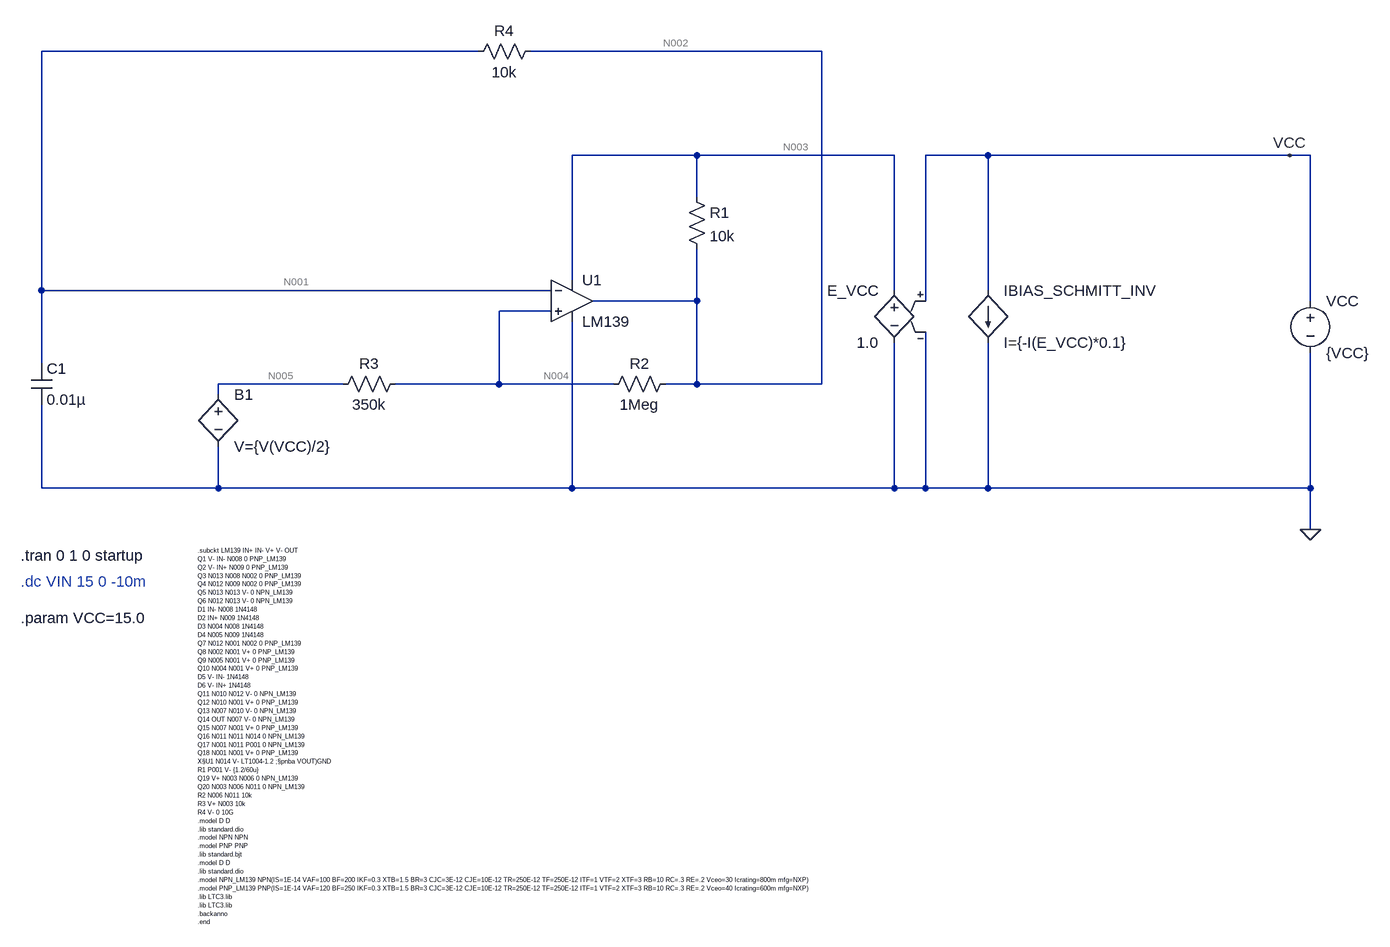
[diagram p0: schematic LM139_Comparator_with_Hysterisis.asc]
LM139_Comparator_with_Hysterisis.asc, the LTspice schematic file:
Version 4.1
SHEET 1 2348 1388
WIRE -16 -592 -688 -592
WIRE 512 -592 64 -592
WIRE 320 -432 128 -432
WIRE 624 -432 320 -432
WIRE 768 -432 672 -432
WIRE 1232 -432 768 -432
WIRE 1264 -432 1232 -432
WIRE 320 -368 320 -432
WIRE 128 -240 128 -432
WIRE -688 -224 -688 -592
WIRE 96 -224 -688 -224
WIRE 624 -224 624 -432
WIRE 768 -224 768 -432
WIRE 320 -208 320 -288
WIRE 320 -208 160 -208
WIRE 672 -208 672 -432
WIRE 1264 -208 1264 -432
WIRE 96 -192 16 -192
WIRE -688 -112 -688 -224
WIRE -224 -80 -416 -80
WIRE 16 -80 16 -192
WIRE 16 -80 -144 -80
WIRE 192 -80 16 -80
WIRE 320 -80 320 -208
WIRE 320 -80 272 -80
WIRE 512 -80 512 -592
WIRE 512 -80 320 -80
WIRE -416 -64 -416 -80
WIRE -688 80 -688 -48
WIRE -416 80 -416 16
WIRE -416 80 -688 80
WIRE 128 80 128 -176
WIRE 128 80 -416 80
WIRE 624 80 624 -144
WIRE 624 80 128 80
WIRE 672 80 672 -160
WIRE 672 80 624 80
WIRE 768 80 768 -144
WIRE 768 80 672 80
WIRE 1264 80 1264 -128
WIRE 1264 80 768 80
WIRE 1264 144 1264 80
FLAG 1264 144 0
FLAG 1232 -432 VCC
SYMBOL OpAmps\\opamp2 128 -272 R0
SYMATTR InstName U1
SYMATTR Value LM139
SYMBOL res 304 -384 R0
SYMATTR InstName R1
SYMATTR Value 10k
SYMBOL res 288 -96 R90
WINDOW 0 0 56 VBottom 2
WINDOW 3 32 56 VTop 2
SYMATTR InstName R2
SYMATTR Value 1Meg
SYMBOL voltage 1264 -224 R0
WINDOW 123 0 0 Left 0
WINDOW 39 0 0 Left 0
SYMATTR InstName VCC
SYMATTR Value {VCC}
SYMBOL res -240 -64 R270
WINDOW 0 32 56 VTop 2
WINDOW 3 0 56 VBottom 2
SYMATTR InstName R3
SYMATTR Value 350k
SYMBOL bv -416 -80 R0
SYMATTR InstName B1
SYMATTR Value V={V(VCC)/2}
SYMBOL res -32 -576 R270
WINDOW 0 32 56 VTop 2
WINDOW 3 0 56 VBottom 2
SYMATTR InstName R4
SYMATTR Value 10k
SYMBOL cap -704 -112 R0
SYMATTR InstName C1
SYMATTR Value 0.01µ
SYMBOL e 624 -240 M0
SYMATTR InstName E_VCC
SYMATTR Value 1.0
SYMBOL bi 768 -224 R0
SYMATTR InstName IBIAS_SCHMITT_INV
SYMATTR Value I={-I(E_VCC)*0.1}
TEXT -448 176 Left 0 !.subckt LM139 IN+ IN- V+ V- OUT\nQ1 V- IN- N008 0 PNP_LM139\nQ2 V- IN+ N009 0 PNP_LM139\nQ3 N013 N008 N002 0 PNP_LM139\nQ4 N012 N009 N002 0 PNP_LM139\nQ5 N013 N013 V- 0 NPN_LM139\nQ6 N012 N013 V- 0 NPN_LM139\nD1 IN- N008 1N4148\nD2 IN+ N009 1N4148\nD3 N004 N008 1N4148\nD4 N005 N009 1N4148\nQ7 N012 N001 N002 0 PNP_LM139\nQ8 N002 N001 V+ 0 PNP_LM139\nQ9 N005 N001 V+ 0 PNP_LM139\nQ10 N004 N001 V+ 0 PNP_LM139\nD5 V- IN- 1N4148\nD6 V- IN+ 1N4148\nQ11 N010 N012 V- 0 NPN_LM139\nQ12 N010 N001 V+ 0 PNP_LM139\nQ13 N007 N010 V- 0 NPN_LM139\nQ14 OUT N007 V- 0 NPN_LM139\nQ15 N007 N001 V+ 0 PNP_LM139\nQ16 N011 N011 N014 0 NPN_LM139\nQ17 N001 N011 P001 0 NPN_LM139\nQ18 N001 N001 V+ 0 PNP_LM139\nX§U1 N014 V- LT1004-1.2 ;§pnba VOUT)GND\nR1 P001 V- {1.2/60u}\nQ19 V+ N003 N006 0 NPN_LM139\nQ20 N003 N006 N011 0 NPN_LM139\nR2 N006 N011 10k\nR3 V+ N003 10k\nR4 V- 0 10G\n.model D D\n.lib standard.dio\n.model NPN NPN\n.model PNP PNP\n.lib standard.bjt\n.model D D\n.lib standard.dio\n.model NPN_LM139 NPN(IS=1E-14 VAF=100 BF=200 IKF=0.3 XTB=1.5 BR=3 CJC=3E-12 CJE=10E-12 TR=250E-12 TF=250E-12 ITF=1 VTF=2 XTF=3 RB=10 RC=.3 RE=.2 Vceo=30 Icrating=800m mfg=NXP)\n.model PNP_LM139 PNP(IS=1E-14 VAF=120 BF=250 IKF=0.3 XTB=1.5 BR=3 CJC=3E-12 CJE=10E-12 TR=250E-12 TF=250E-12 ITF=1 VTF=2 XTF=3 RB=10 RC=.3 RE=.2 Vceo=40 Icrating=600m mfg=NXP)\n.lib LTC3.lib\n.lib LTC3.lib\n.backanno\n.end
TEXT -720 224 Left 2 ;.dc VIN 15 0 -10m
TEXT -720 184 Left 2 !.tran 0 1 0 startup
TEXT -720 280 Left 2 !.param VCC=15.0

The netlist it stands for:
* LM139_Comparator_with_Hysterisis.asc
X§U1 N004 N001 N003 0 N002 LM139  ; pins In+ In- V+ V- OUT
R1 N003 N002 10k
R2 N002 N004 1Meg
VCC VCC 0 {VCC}
R3 N005 N004 350k
B1 N005 0 V={V(VCC)/2}
R4 N001 N002 10k
C1 N001 0 0.01µ
E_VCC N003 0 VCC 0 1.0
B§IBIAS_SCHMITT_INV VCC 0 I={-I(E_VCC)*0.1}
.subckt LM139 IN+ IN- V+ V- OUT
Q1 V- IN- N008 0 PNP_LM139
Q2 V- IN+ N009 0 PNP_LM139
Q3 N013 N008 N002 0 PNP_LM139
Q4 N012 N009 N002 0 PNP_LM139
Q5 N013 N013 V- 0 NPN_LM139
Q6 N012 N013 V- 0 NPN_LM139
D1 IN- N008 1N4148
D2 IN+ N009 1N4148
D3 N004 N008 1N4148
D4 N005 N009 1N4148
Q7 N012 N001 N002 0 PNP_LM139
Q8 N002 N001 V+ 0 PNP_LM139
Q9 N005 N001 V+ 0 PNP_LM139
Q10 N004 N001 V+ 0 PNP_LM139
D5 V- IN- 1N4148
D6 V- IN+ 1N4148
Q11 N010 N012 V- 0 NPN_LM139
Q12 N010 N001 V+ 0 PNP_LM139
Q13 N007 N010 V- 0 NPN_LM139
Q14 OUT N007 V- 0 NPN_LM139
Q15 N007 N001 V+ 0 PNP_LM139
Q16 N011 N011 N014 0 NPN_LM139
Q17 N001 N011 P001 0 NPN_LM139
Q18 N001 N001 V+ 0 PNP_LM139
X§U1 N014 V- LT1004-1.2 ;§pnba VOUT)GND
R1 P001 V- {1.2/60u}
Q19 V+ N003 N006 0 NPN_LM139
Q20 N003 N006 N011 0 NPN_LM139
R2 N006 N011 10k
R3 V+ N003 10k
R4 V- 0 10G
.model D D
.lib standard.dio
.model NPN NPN
.model PNP PNP
.lib standard.bjt
.model D D
.lib standard.dio
.model NPN_LM139 NPN(IS=1E-14 VAF=100 BF=200 IKF=0.3 XTB=1.5 BR=3 CJC=3E-12 CJE=10E-12 TR=250E-12 TF=250E-12 ITF=1 VTF=2 XTF=3 RB=10 RC=.3 RE=.2 Vceo=30 Icrating=800m mfg=NXP)
.model PNP_LM139 PNP(IS=1E-14 VAF=120 BF=250 IKF=0.3 XTB=1.5 BR=3 CJC=3E-12 CJE=10E-12 TR=250E-12 TF=250E-12 ITF=1 VTF=2 XTF=3 RB=10 RC=.3 RE=.2 Vceo=40 Icrating=600m mfg=NXP)
.lib LTC3.lib
.lib LTC3.lib
.backanno
.end
* .dc VIN 15 0 -10m
.tran 0 1 0 startup
.param VCC=15.0
.backanno
.end